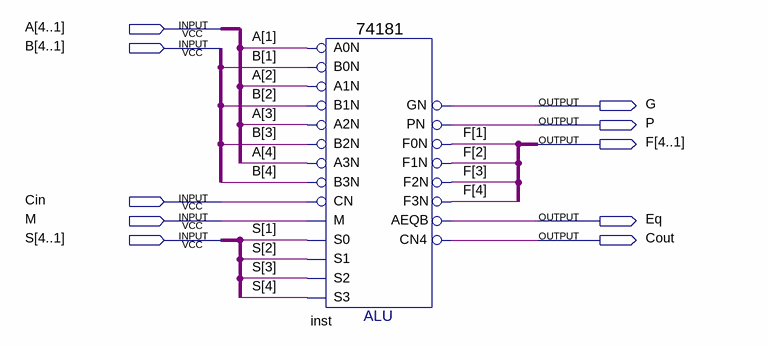
[diagram p0: schematic sheet]
// Quartus schematic alu_sch.bdf as structural Verilog: 1 symbols, 10 pins
module alu_sch (
  input  [4:1] A,
  input  [4:1] B,
  input  Cin,
  input  M,
  input  [4:1] S,
  output G,
  output P,
  output [4:1] F,
  output Eq,
  output Cout
);

  \74181  inst (
    .B0N(B[1]), .A0N(A[1]), .A1N(A[2]), .B1N(B[2]), .A3N(A[4]), .B2N(B[3]), .A2N(A[3]), .M(M), .CN(Cin),
    .B3N(B[4]), .S2(S[3]), .S1(S[2]), .S0(S[1]), .S3(S[4]), .PN(P), .GN(G), .F3N(F[4]), .F1N(F[2]),
    .F0N(F[1]), .AEQB(Eq), .CN4(Cout), .F2N(F[3]));
endmodule
